# Altium schematic sheet light-motor-control-power-supply-annotation-text-5pt.SchDoc
size 143 x 98 mm
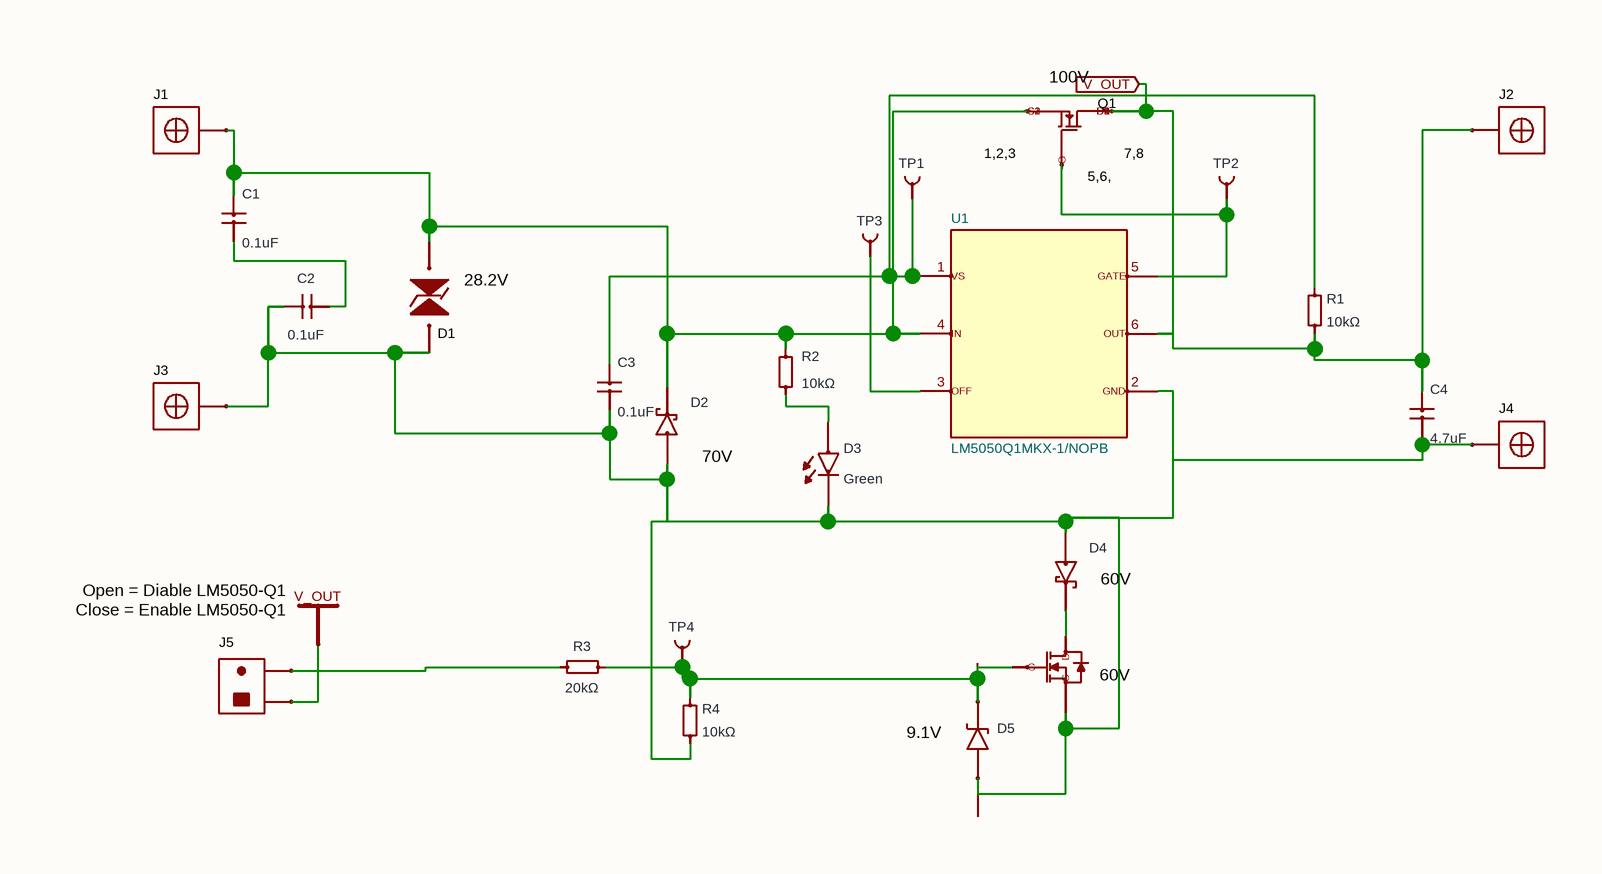
[diagram p0: light-motor-control-power-supply-annotation-text-5pt.SchDoc]

## Parts
C1  0.1uF
C2  0.1uF
C3  0.1uF
C4  4.7uF
D1  (no value)
D2  (no value)
D3  Green
D4  (no value)
D5  (no value)
J1  (no value)
J2  (no value)
J3  (no value)
J4  (no value)
J5  (no value)
Q1  (no value)
Q2  (no value)
R1  10kΩ
R2  10kΩ
R3  20kΩ
R4  10kΩ
TP1  (no value)
TP2  (no value)
TP3  (no value)
TP4  (no value)
U1  (no value)

## Nets
V_OUT: C4.1(anode) J2.1(pin1) J5.2(pin2) Q1.5(D5) Q1.6(D4) Q1.7(D3) Q1.8(D2) Q1.9(D1) R1.1(anode) U1.6(OUT)
NetC1_1: C1.1(anode) C3.1(anode) D1.2(pin2) D2.2(neg) J1.1(pin1) Q1.1(S3) Q1.2(S2) Q1.3(S1) R1.2(cathode) R2.2(cathode) TP1.1(pin1) U1.1(VS) U1.4(IN)
NetC1_2: C1.2(cathode) C2.2(neg)
NetC2_1: C2.1(pos) C3.2(cathode) C4.2(cathode) D1.1(pin1) D2.1(pos) D3.2(cathode) D4.1(pos) D5.1(anode) D5.2(cathode) J3.1(pin1) J4.1(pin1) Q2.1(G) Q2.2(S) R3.2(cathode) R4.1(anode) R4.2(cathode) TP4.1(pin1) U1.2(GND)
NetD3_1: D3.1(anode) R2.1(anode)
NetD4_2: D4.2(neg) Q2.3(D)
NetJ5_1: J5.1(pin1) R3.1(anode)
NetQ1_4: Q1.4(G) TP2.1(pin1) U1.5(GATE)
NetTP3_1: TP3.1(pin1) U1.3(OFF)

## Notes on the sheet
- (near Q1) 100V
- (near Q1) Q1
- (near D1) 28.2V
- (near Q1) 1,2,3
- (near Q1) 5,6,
- (near Q1) 7,8
- (near D2) 70V
- (near J5) Open = Diable LM5050-Q1
- (near J5) Close = Enable LM5050-Q1
- (near D4) 60V
- (near Q2) 60V
- (near D5) 9.1V
- (in symbol U1) LM5050Q1MKX-1/NOPB

## Library data of the parts
C1 C3 C4 = capacitor_down
C2 = capacitor_right
D1 = D1
D2 = schottky_diode_up
D3 = led_down
D4 = schottky_diode_down
D5 = zener_diode_vert
J1 = J1
J2 = J2
J3 = J3
J4 = J4
J5 = J5
Q1 = Q1
Q2 = Q2
R1 R2 R4 = boxresistor_up
R3 = boxresistor_right
TP1-TP4 = testpoint_up
U1 = U1